# Altium schematic sheet ModbusYoRadio.SchDoc
size A4; SheetNumber: 1; SheetTotal: 1
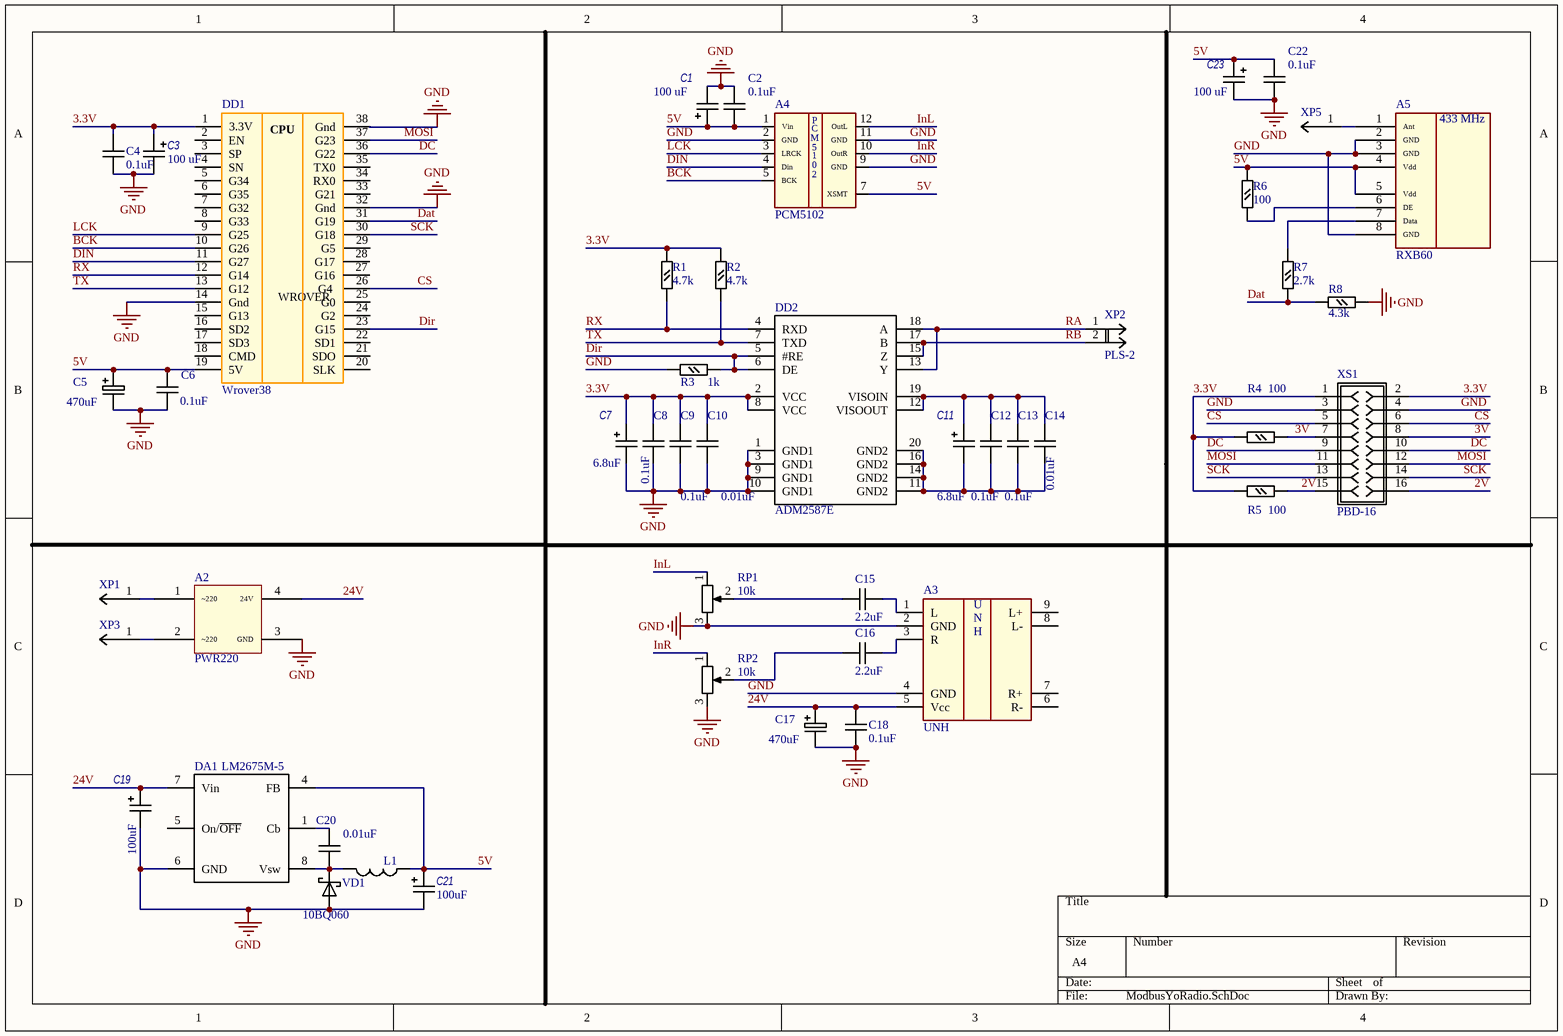
[diagram p0: ModbusYoRadio.SchDoc]

## Parts
A2  PWR220  [PWR220_1]
A3  UNH  [UNH]
A4  PCM5102  [PCM5102]
A5  RXB60  [RXB60]
C1  100 uF  [TC3216-1206-A]
C2  0.1uF  [cap0805]
C3  100 uF  [TC3216-1206-A]
C4  0.1uF  [cap0805]
C5  470uF  [ECR-EHR 10mm]
C6  0.1uF  [cap0805]
C7  6.8uF  [TC3216-1206-A]
C8  0.1uF  [cap0805]
C9  0.1uF  [cap0805]
C10  0.01uF  [cap0805]
C11  6.8uF  [TC3216-1206-A]
C12  0.1uF  [cap0805]
C13  0.1uF  [cap0805]
C14  0.01uF  [cap0805]
C15  2.2uF  [cap0805]
C16  2.2uF  [cap0805]
C17  470uF  [ECR-EHR 10mm]
C18  0.1uF  [cap0805]
C19  100uF  [TC7360-2924-E]
C20  0.01uF  [cap0805]
C21  100uF  [TC7360-2924-E]
C22  0.1uF  [cap0805]
C23  100 uF  [TC3216-1206-A]
DA1  LM2675M-5  [SO-8]
DD1  Wrover38  [Wrover]
DD2  ADM2587E  [SO-20]
L1  RLB0914-470KL  [RLB0914]  (value not drawn)
R1  4.7k  [res0805]
R2  4.7k  [res0805]
R3  1k  [res0805]
R4  100  [res0805]
R5  100  [res0805]
R6  100  [res0805]
R7  2.7k  [res0805]
R8  4.3k  [res0805]
RP1  10k  [CA-6V]
RP2  10k  [CA-6V]
VD1  10BQ060  [SMB]
XP1  PLS-1  [PLS1]  (value not drawn)
XP2  PLS-2  [PLS2]
XP3  PLS-1  [PLS1]  (value not drawn)
XP5  PLS-1  [PLS1]  (value not drawn)
XS1  PBD-16  [PBD-16]

## Nets
GND: A2.3(GND) A3.2(GND) A3.4(GND) A4.2(GND) A4.9(GND) A4.11(GND) A5.2(GND) A5.3(GND) A5.8(GND) C1.2 C2.2 C3.2 C4.2 C5.2 C6.2 C7.2 C8.1 C9.1 C10.1 C17.2 C18.2 C19.2 C21.2 C22.1 C23.2 DA1.2(GND) DA1.3(GND) DA1.6(GND) DD1.14(Gnd) DD1.32(Gnd) DD2.1(GND1) DD2.3(GND1) DD2.9(GND1) DD2.10(GND1) R3.1 R8.1 RP1.3 RP2.3 VD1.1(A) XS1.3 XS1.4
2V: R5.2 XS1.15 XS1.16
3.3V: C3.1 C4.1 C7.1 C8.2 C9.2 C10.2 DD1.1(3.3V) DD2.2(VCC) DD2.8(VCC) R1.2 R2.2 R4.1 R5.1 XS1.1 XS1.2
3V: R4.2 XS1.7 XS1.8
5V: A4.1(Vin) A4.7(XSMT) A5.4(Vdd) A5.5(Vdd) C1.1 C2.1 C5.1 C6.1 C21.1 C22.2 C23.1 DA1.4(FB) DD1.19(5V) L1.1 R6.2
24V: A2.4(24V) A3.5(Vcc) C17.1 C18.1 C19.1 DA1.7(Vin)
BCK: A4.5(BCK) DD1.10(G26)
CS: DD1.26(G4) XS1.5 XS1.6
Dat: DD1.31(G19) R7.1 R8.2
DC: DD1.36(G22) XS1.9 XS1.10
DIN: A4.4(Din) DD1.11(G27)
Dir: DD1.23(G15) DD2.5(#RE) DD2.6(DE) R3.2
InL: A4.12(OutL) RP1.1
InR: A4.10(OutR) RP2.1
LCK: A4.3(LRCK) DD1.9(G25)
MOSI: DD1.37(G23) XS1.11 XS1.12
RA: DD2.13(Y) DD2.18(A) XP2.1
RB: DD2.15(Z) DD2.17(B) XP2.2
RX: DD1.12(G14) DD2.4(RXD) R1.1
SCK: DD1.30(G18) XS1.13 XS1.14
TX: DD1.13(G12) DD2.7(TXD) R2.1
NetA2_1: A2.1(~220) XP1.1
NetA2_2: A2.2(~220) XP3.1
NetA3_1: A3.1(L) C15.2
NetA3_3: A3.3(R) C16.2
NetA5_1: A5.1(Ant) XP5.1
NetA5_6: A5.6(DE) R6.1
NetA5_7: A5.7(Data) R7.2
NetC11_1: C11.1 C12.1 C13.1 C14.1 DD2.12(VISOOUT) DD2.19(VISOIN)
NetC11_2: C11.2 C12.2 C13.2 C14.2 DD2.11(GND2) DD2.14(GND2) DD2.16(GND2) DD2.20(GND2)
NetC15_1: C15.1 RP1.2
NetC16_1: C16.1 RP2.2
NetC20_1: C20.1 DA1.1(Cb)
NetC20_2: C20.2 DA1.8(Vsw) L1.2 VD1.2(K)

Not connected (* = marked no-connect by the designer): A3 6(R-) 7(R+) 8(L-) 9(L+); DA1 5(On/~{OFF}); DD1 2(EN) 3(SP) 4(SN) 5(G34) 6(G35) 7(G32) 8(G33) 15(G13) 16(SD2) 17(SD3) 18(CMD) 20(SLK) 21(SDO) 22(SD1) 24(G2) 25(G0) 27(G16) 28(G17) 29(G5) 33(G21) 34(RX0) 35(TX0) 38(Gnd)

## Notes on the sheet
- (in symbol PCM5102) P; C; M; 0
- (in symbol RXB60) 433 MHz
- (in symbol UNH) U; N; H
- (in symbol Wrover38) CPU; WROVER

## Library data of the parts
C1 C3 C7 C11 C23 = capA: Танталовый конденсатор, SMD; Part Number: capA; Group: Конденсаторы; NPads: 2; SType: SMD
  C1 C3 C23: ValueSCH: 100 uF; Package: SMD E
  C7 C11: ValueSCH: 6.8uF; Package: SMD A
C2 C4 C6 C8-C10 C12-C16 C18 C20 C22 = cap0805: Керамический конденсатор, SMD; Group: Конденсаторы; NPads: 2; Part Number: cap0805; SType: SMD; Package: SMD 0805
  C2 C4 C6 C8 C9 C12 C13 C18 C22: ValueSCH: 0.1uF
  C10 C14 C20: ValueSCH: 0.01uF
  C15 C16: ValueSCH: 2.2uF
C5 C17 = ECR/EHR/EXR D=10mm: Алюминиевый конденсатор Hitano; Group: Конденсаторы; SType: TH; NPads: 2; Part Number: ECR/EHR/EXR D=10mm; ValueSCH: 470uF; Package: ECR/HER
C19 C21 = capE: Танталовый конденсатор, SMD; Part Number: capE; Group: Конденсаторы; NPads: 2; ValueSCH: 100uF; SType: SMD; Package: SMD E
DA1 = LM2675M-5: Понижающий DC-DC 5V 1А; Group: Микросхемы; SType: SMD; NPads: 8; Part Number: LM2675M-5; ValueSCH: LM2675M-5; Package: SO-8
DD2 = ADM2587E: Трансивер RS-485 / RS-422; Group: Микросхемы; SType: SMD; NPads: 20; Part Number: ADM2587E; ValueSCH: ADM2587E; Package: SO-20W
L1 = RLB0914-330KL: Катушка 33 мкГн 1,7 А; Group: Индуктивности; SType: TH; NPads: 2; Part Number: RLB0914-330KL; ValueSCH: RLB0914-470KL; Package: RLB0914
R1-R8 = res0805: Резистор 0.125 W, SMD; Group: Резисторы; NPads: 2; Part Number: res0805; SType: SMD; Package: SMD 0805
  R1 R2: ValueSCH: 4.7k
  R3: ValueSCH: 1k
  R4-R6: ValueSCH: 100
  R7: ValueSCH: 2.7k
  R8: ValueSCH: 4.3k
RP1 RP2 = CA-6V: Резистор переменный; Group: Резисторы; SType: TH; NPads: 3; Part Number: CA-6V; ValueSCH: 10k; Package: CA-6V
VD1 = 10BQ060: Диод шоттки 60V 1A; Group: Диоды; SType: SMD; NPads: 2; Part Number: 10BQ060; ValueSCH: 10BQ060; Package: SMB
XP1 XP3 XP5 = PLS-1: Однорядный штыревой разъем 1 шаг 2.54мм; Group: Разъемы; SType: TH; NPads: 1; Part Number: PLS-1; ValueSCH: PLS-1
XP2 = PLS-2: Однорядный штыревой разъем 2 шаг 2.54мм; Group: Разъемы; SType: TH; NPads: 2; Part Number: PLS-2; ValueSCH: PLS-2
XS1 = PBD-16: Розетка на плату 8х2 контактов.2,54 х 2,54 мм; Group: Разъемы; SType: TH; NPads: 16; Part Number: PBD-16; ValueSCH: PBD-16